# Altium schematic sheet Sensors Test.SchDoc
size A; SheetNumber: 13; SheetTotal: 19
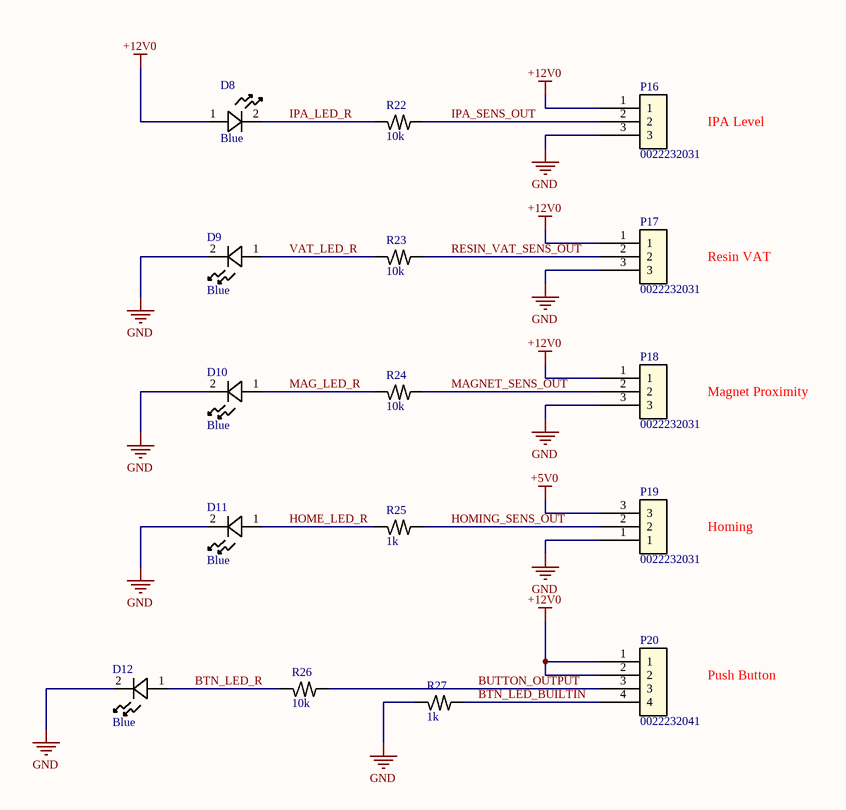
[diagram p0: Sensors Test.SchDoc]

## Parts
D8  Blue  [LED0805 BLUE]
D9  Blue  [LED0805 BLUE]
D10  Blue  [LED0805 BLUE]
D11  Blue  [LED0805 BLUE]
D12  Blue  [LED0805 BLUE]
P16  0022232031  [Signal3]
P17  0022232031  [Signal3]
P18  0022232031  [Signal3]
P19  0022232031  [Signal3]
P20  0022232041  [Signal4]
R22  10k  [R0603]
R23  10k  [R0603]
R24  10k  [R0603]
R25  1k  [R0603]
R26  10k  [R0603]
R27  1k  [R0603]

## Nets
+5V0: P19.3
+12V0: D8.1 P16.1 P17.1 P18.1 P20.1 P20.2
GND: D9.2 D10.2 D11.2 D12.2 P16.3 P17.3 P18.3 P19.1 R27.2
BTN_LED_BUILTIN: P20.4 R27.1
BTN_LED_R: D12.1 R26.2
BUTTON_OUTPUT: P20.3 R26.1
HOME_LED_R: D11.1 R25.2
HOMING_SENS_OUT: P19.2 R25.1
IPA_LED_R: D8.2 R22.2
IPA_SENS_OUT: P16.2 R22.1
MAG_LED_R: D10.1 R24.2
MAGNET_SENS_OUT: P18.2 R24.1
RESIN_VAT_SENS_OUT: P17.2 R23.1
VAT_LED_R: D9.1 R23.2

## Notes on the sheet
- IPA Level
- Resin VAT
- Magnet Proximity
- Homing
- Push Button
- Project:
- Sheet Title:
- Size
- Date:
- A
- Sheet Number:
- Sheet Total:
- Revision:
- Time:
- Author:

## Library data of the parts
D8-D12 = LED: LED BLUE WATER CLEAR 0805 SMD; MF: XINGLIGHT; MP: XL-TD2012UBC; ComponentLink1Description: Datasheet; ComponentLink1URL: https://www.lcsc.com/datasheet/C5349940.pdf; ComponentLink2Description: Supplier1; ComponentLink2URL: https://www.lcsc.com/product-detail/C5349940.html
P16-P19 = Signal3: SignalConnector, 3 leads; MF: Molex; MP: 0022232031; ComponentLink1Description: Datasheet; ComponentLink1URL: https://tools.molex.com/pdm_docs/sd/022232031_sd.pdf; ComponentLink2Description: Supplier1; ComponentLink2URL: https://www.digikey.com/en/products/detail/molex/0022232031/26669
P20 = Signal4: SignalConnector, 4 leads; MF: Molex; ComponentLink1Description: Datasheet; ComponentLink1URL: https://tools.molex.com/pdm_docs/ps/PS-10-07-001.pdf; ComponentLink2Description: Supplier1; ComponentLink2URL: https://www.digikey.com/en/products/detail/molex/0022232041/26671; MP: 0022232041
R22-R24 R26 = Res: RES 10kΩ ±1% 100mW 0603; MF: FOJAN; MP: FRC0603F1002TS; ComponentLink1Description: Datasheet; ComponentLink1URL: https://www.lcsc.com/datasheet/C2906982.pdf; ComponentLink2Description: Supplier1; ComponentLink2URL: https://www.lcsc.com/product-detail/C2906982.html
R25 R27 = Res: RES 1kΩ ±5% 100mW 0603; MF: VO; MP: SCR0603J1K; ComponentLink1Description: Datasheet; ComponentLink1URL: https://www.lcsc.com/datasheet/C3017736.pdf; ComponentLink2Description: Supplier1; ComponentLink2URL: https://www.lcsc.com/product-detail/C3017736.html